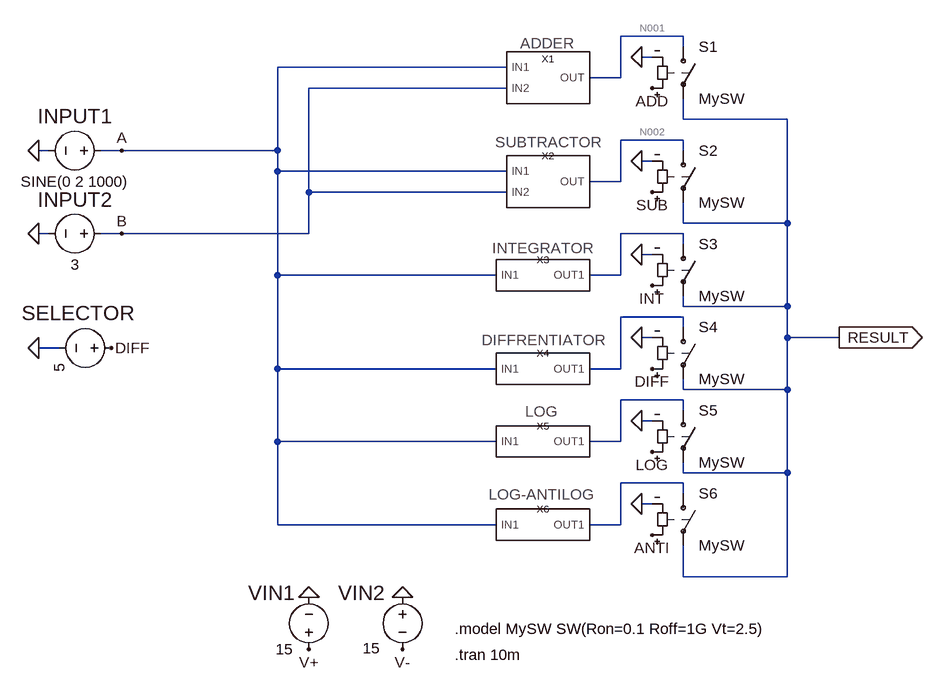
[diagram p0: schematic MAINCALCULATOR.asc]
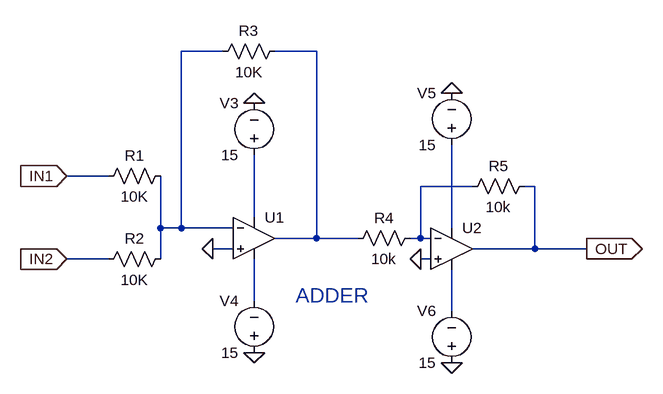
[diagram p1: sub-circuit adderblock.asc]
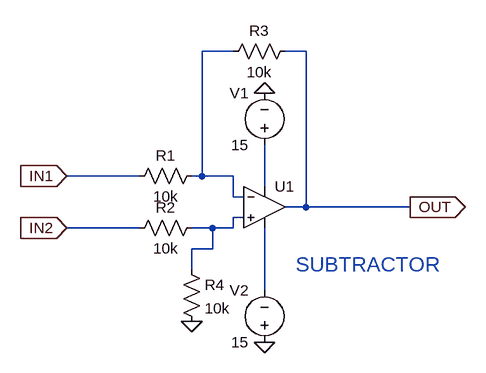
[diagram p2: sub-circuit subtractorblock.asc]
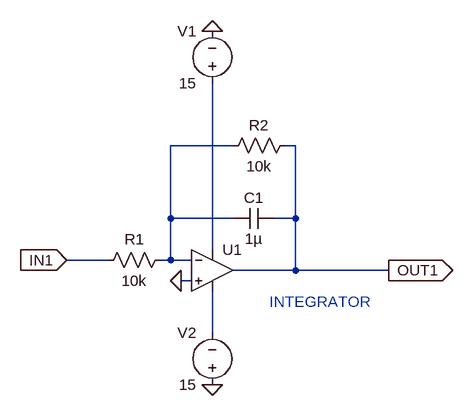
[diagram p3: sub-circuit integratorblock.asc]
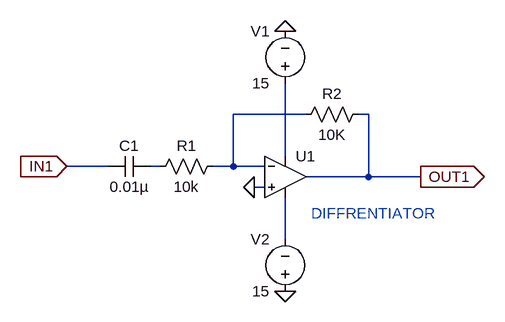
[diagram p4: sub-circuit diffrenetiatorblock.asc]
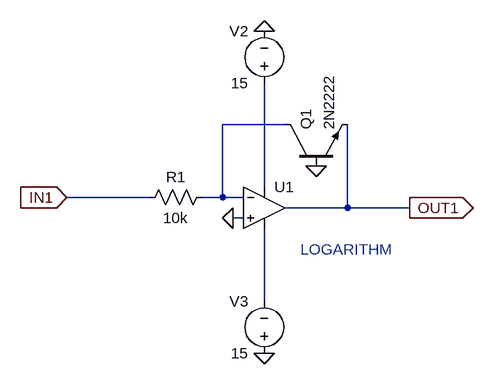
[diagram p5: sub-circuit logblock.asc]
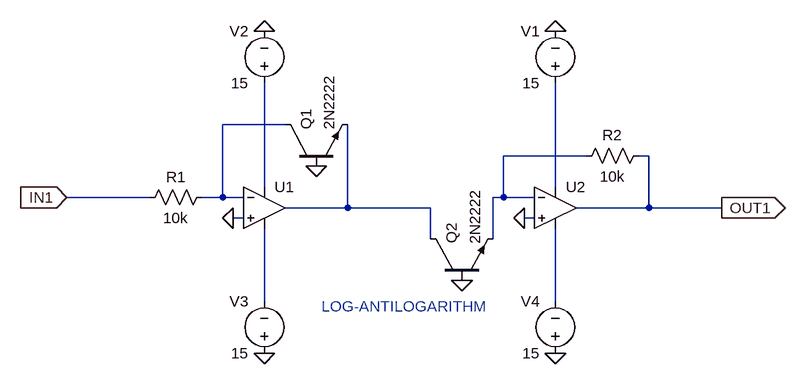
[diagram p6: sub-circuit logantilogblock.asc]
MAINCALCULATOR.asc, the LTspice schematic file:
Version 4.1
SHEET 1 900 1088
WIRE 416 64 320 64
WIRE 416 80 416 64
WIRE 368 96 352 96
WIRE 144 112 -208 112
WIRE 320 128 320 64
WIRE 320 128 272 128
WIRE 144 144 -160 144
WIRE 416 192 416 160
WIRE 576 192 416 192
WIRE 416 224 320 224
WIRE -560 240 -576 240
WIRE -448 240 -480 240
WIRE -208 240 -208 112
WIRE -208 240 -448 240
WIRE 416 240 416 224
WIRE 368 256 352 256
WIRE -208 272 -208 240
WIRE 144 272 -208 272
WIRE 320 288 320 224
WIRE 320 288 272 288
WIRE -160 304 -160 144
WIRE 144 304 -160 304
WIRE 416 352 416 320
WIRE 576 352 576 192
WIRE 576 352 416 352
WIRE -560 368 -576 368
WIRE -448 368 -480 368
WIRE -160 368 -160 304
WIRE -160 368 -448 368
WIRE 416 368 320 368
WIRE 416 384 416 368
WIRE 368 400 352 400
WIRE -208 432 -208 272
WIRE 128 432 -208 432
WIRE 320 432 320 368
WIRE 320 432 272 432
WIRE 416 480 416 464
WIRE 576 480 576 352
WIRE 576 480 416 480
WIRE 416 496 320 496
WIRE 416 512 416 496
WIRE 368 528 352 528
WIRE 576 528 576 480
WIRE 656 528 576 528
WIRE -544 544 -576 544
WIRE -208 576 -208 432
WIRE 128 576 -208 576
WIRE 320 576 320 496
WIRE 320 576 272 576
WIRE 416 608 416 592
WIRE 576 608 576 528
WIRE 576 608 416 608
WIRE 416 624 320 624
WIRE 416 640 416 624
WIRE 368 656 352 656
WIRE -208 688 -208 576
WIRE 128 688 -208 688
WIRE 320 688 320 624
WIRE 320 688 272 688
WIRE 416 736 416 720
WIRE 576 736 576 608
WIRE 576 736 416 736
WIRE 416 752 320 752
WIRE 416 768 416 752
WIRE 368 784 352 784
WIRE -208 816 -208 688
WIRE 128 816 -208 816
WIRE 320 816 320 752
WIRE 320 816 272 816
WIRE 416 896 416 848
WIRE 576 896 576 736
WIRE 576 896 416 896
FLAG -576 240 0
FLAG -576 368 0
FLAG -448 240 A
FLAG -448 368 B
FLAG 352 96 0
FLAG 352 256 0
FLAG 352 400 0
FLAG 352 528 0
FLAG 352 656 0
FLAG 352 784 0
FLAG 368 144 ADD
FLAG 368 304 SUB
FLAG 368 448 INT
FLAG 368 576 DIFF
FLAG 368 704 LOG
FLAG 368 832 ANTI
FLAG -16 1008 V-
FLAG -160 1008 V+
FLAG 656 528 RESULT
IOPIN 656 528 Out
FLAG -576 544 0
FLAG -464 544 DIFF
FLAG -16 928 0
FLAG -160 928 0
SYMBOL adderblock 208 128 R0
SYMATTR InstName X1
SYMBOL subtractorblock 208 288 R0
SYMATTR InstName X2
SYMBOL integratorblock 192 432 R0
SYMATTR InstName X3
SYMBOL diffrenetiatorblock 192 576 R0
SYMATTR InstName X4
SYMBOL logblock 192 688 R0
SYMATTR InstName X5
SYMBOL logantilogblock 192 816 R0
SYMATTR InstName X6
SYMBOL voltage -464 240 R90
WINDOW 0 -32 56 VBottom 3
WINDOW 3 32 56 VTop 2
WINDOW 123 0 0 Left 0
WINDOW 39 0 0 Left 0
SYMATTR InstName INPUT1
SYMATTR Value SINE(0 2 1000)
SYMBOL voltage -464 368 R90
WINDOW 0 -32 56 VBottom 3
WINDOW 3 32 56 VTop 2
WINDOW 123 0 0 Left 0
WINDOW 39 0 0 Left 0
SYMATTR InstName INPUT2
SYMATTR Value 3
SYMBOL sw 416 64 R0
SYMATTR InstName S1
SYMATTR Value MySW
SYMBOL sw 416 224 R0
SYMATTR InstName S2
SYMATTR Value MySW
SYMBOL sw 416 368 R0
SYMATTR InstName S3
SYMATTR Value MySW
SYMBOL sw 416 496 R0
SYMATTR InstName S4
SYMATTR Value MySW
SYMBOL sw 416 624 R0
SYMATTR InstName S5
SYMATTR Value MySW
SYMBOL sw 416 752 R0
SYMATTR InstName S6
SYMATTR Value MySW
SYMBOL voltage -448 544 R90
WINDOW 123 0 0 Left 0
WINDOW 39 0 0 Left 0
WINDOW 0 -54 -18 VRight 3
SYMATTR InstName SELECTOR
SYMATTR Value 5
SYMBOL voltage -16 912 R0
WINDOW 123 0 0 Left 0
WINDOW 39 0 0 Left 0
WINDOW 0 -63 9 Center 3
WINDOW 3 -61 94 Left 2
SYMATTR InstName VIN2
SYMATTR Value 15
SYMBOL voltage -160 1024 R180
WINDOW 0 58 103 Center 3
WINDOW 3 24 16 Left 2
WINDOW 123 0 0 Left 0
WINDOW 39 0 0 Left 0
SYMATTR InstName VIN1
SYMATTR Value 15
TEXT 64 976 Left 2 !.model MySW SW(Ron=0.1 Roff=1G Vt=2.5)
TEXT 64 1016 Left 2 !.tran 10m

adderblock.asc, the sub-circuit schematic file:
Version 4.1
SHEET 1 880 680
WIRE 48 -144 -16 -144
WIRE 192 -144 128 -144
WIRE -128 48 -192 48
WIRE 432 64 352 64
WIRE 528 64 512 64
WIRE 96 112 96 16
WIRE -48 128 -48 48
WIRE -16 128 -16 -144
WIRE -16 128 -48 128
WIRE 64 128 -16 128
WIRE 400 128 400 0
WIRE 192 144 192 -144
WIRE 192 144 128 144
WIRE 256 144 192 144
WIRE 352 144 352 64
WIRE 352 144 336 144
WIRE 368 144 352 144
WIRE 64 160 32 160
WIRE 528 160 528 64
WIRE 528 160 432 160
WIRE 608 160 528 160
WIRE -128 176 -192 176
WIRE -48 176 -48 128
WIRE 368 176 352 176
WIRE 96 240 96 176
WIRE 400 256 400 192
FLAG 32 160 0
FLAG 96 -64 0
FLAG 96 320 0
FLAG 352 176 0
FLAG 400 336 0
FLAG 400 -80 0
FLAG -192 48 IN1
IOPIN -192 48 In
FLAG -192 176 IN2
IOPIN -192 176 In
FLAG 608 160 OUT
IOPIN 608 160 Out
SYMBOL res -32 32 R90
WINDOW 0 0 56 VBottom 2
WINDOW 3 32 56 VTop 2
SYMATTR InstName R1
SYMATTR Value 10K
SYMBOL res -32 160 R90
WINDOW 0 0 56 VBottom 2
WINDOW 3 32 56 VTop 2
SYMATTR InstName R2
SYMATTR Value 10K
SYMBOL OpAmps\\UniversalOpAmp 96 144 R0
SYMATTR InstName U1
SYMBOL voltage 96 32 R180
WINDOW 0 24 96 Left 2
WINDOW 3 24 16 Left 2
WINDOW 123 0 0 Left 0
WINDOW 39 0 0 Left 0
SYMATTR InstName V3
SYMATTR Value 15
SYMBOL voltage 96 336 R180
WINDOW 0 24 96 Left 2
WINDOW 3 24 16 Left 2
WINDOW 123 0 0 Left 0
WINDOW 39 0 0 Left 0
SYMATTR InstName V4
SYMATTR Value 15
SYMBOL res 144 -160 R90
WINDOW 0 0 56 VBottom 2
WINDOW 3 32 56 VTop 2
SYMATTR InstName R3
SYMATTR Value 10K
SYMBOL OpAmps\\UniversalOpAmp 400 160 R0
SYMATTR InstName U2
SYMBOL res 352 128 R90
WINDOW 0 0 56 VBottom 2
WINDOW 3 32 56 VTop 2
SYMATTR InstName R4
SYMATTR Value 10k
SYMBOL res 528 48 R90
WINDOW 0 0 56 VBottom 2
WINDOW 3 32 56 VTop 2
SYMATTR InstName R5
SYMATTR Value 10k
SYMBOL voltage 400 16 R180
WINDOW 0 24 96 Left 2
WINDOW 3 24 16 Left 2
WINDOW 123 0 0 Left 0
WINDOW 39 0 0 Left 0
SYMATTR InstName V5
SYMATTR Value 15
SYMBOL voltage 400 352 R180
WINDOW 0 24 96 Left 2
WINDOW 3 24 16 Left 2
WINDOW 123 0 0 Left 0
WINDOW 39 0 0 Left 0
SYMATTR InstName V6
SYMATTR Value 15
TEXT 160 232 Left 3 ;ADDER

subtractorblock.asc, the sub-circuit schematic file:
Version 4.1
SHEET 1 880 680
WIRE 128 -64 80 -64
WIRE 240 -64 208 -64
WIRE -16 128 -128 128
WIRE 80 128 80 -64
WIRE 80 128 64 128
WIRE 128 128 80 128
WIRE 176 144 176 80
WIRE 128 160 128 128
WIRE 144 160 128 160
WIRE 240 176 240 -64
WIRE 240 176 208 176
WIRE 400 176 240 176
WIRE 144 192 128 192
WIRE -16 208 -128 208
WIRE 96 208 64 208
WIRE 128 208 128 192
WIRE 128 208 96 208
WIRE 96 240 96 208
WIRE 96 240 64 240
WIRE 64 272 64 240
WIRE 176 304 176 208
FLAG 176 384 0
FLAG 176 0 0
FLAG 64 352 0
FLAG -128 128 IN1
IOPIN -128 128 In
FLAG -128 208 IN2
IOPIN -128 208 In
FLAG 400 176 OUT
IOPIN 400 176 Out
SYMBOL OpAmps\\UniversalOpAmp 176 176 R0
SYMATTR InstName U1
SYMBOL voltage 176 96 R180
WINDOW 0 24 96 Left 2
WINDOW 3 24 16 Left 2
WINDOW 123 0 0 Left 0
WINDOW 39 0 0 Left 0
SYMATTR InstName V1
SYMATTR Value 15
SYMBOL voltage 176 400 R180
WINDOW 0 24 96 Left 2
WINDOW 3 24 16 Left 2
WINDOW 123 0 0 Left 0
WINDOW 39 0 0 Left 0
SYMATTR InstName V2
SYMATTR Value 15
SYMBOL res 80 112 R90
WINDOW 0 0 56 VBottom 2
WINDOW 3 32 56 VTop 2
SYMATTR InstName R1
SYMATTR Value 10k
SYMBOL res 80 192 R90
WINDOW 0 0 56 VBottom 2
WINDOW 3 32 56 VTop 2
SYMATTR InstName R2
SYMATTR Value 10k
SYMBOL res 224 -80 R90
WINDOW 0 0 56 VBottom 2
WINDOW 3 32 56 VTop 2
SYMATTR InstName R3
SYMATTR Value 10k
SYMBOL res 48 256 R0
SYMATTR InstName R4
SYMATTR Value 10k
TEXT 224 264 Left 3 ;SUBTRACTOR

integratorblock.asc, the sub-circuit schematic file:
Version 4.1
SHEET 1 880 680
WIRE 272 -32 176 -32
WIRE 368 -32 352 -32
WIRE 176 80 176 -32
WIRE 272 80 176 80
WIRE 368 80 368 -32
WIRE 368 80 336 80
WIRE 240 128 240 -128
WIRE 80 144 16 144
WIRE 176 144 176 80
WIRE 176 144 160 144
WIRE 208 144 176 144
WIRE 368 160 368 80
WIRE 368 160 272 160
WIRE 512 160 368 160
WIRE 208 176 192 176
WIRE 240 256 240 192
FLAG 240 -208 0
FLAG 240 336 0
FLAG 192 176 0
FLAG 16 144 IN1
IOPIN 16 144 In
FLAG 512 160 OUT1
IOPIN 512 160 Out
SYMBOL OpAmps\\UniversalOpAmp 240 160 R0
SYMATTR InstName U1
SYMBOL voltage 240 -112 R180
WINDOW 0 24 96 Left 2
WINDOW 3 24 16 Left 2
WINDOW 123 0 0 Left 0
WINDOW 39 0 0 Left 0
SYMATTR InstName V1
SYMATTR Value 15
SYMBOL voltage 240 352 R180
WINDOW 0 24 96 Left 2
WINDOW 3 24 16 Left 2
WINDOW 123 0 0 Left 0
WINDOW 39 0 0 Left 0
SYMATTR InstName V2
SYMATTR Value 15
SYMBOL res 176 128 R90
WINDOW 0 0 56 VBottom 2
WINDOW 3 32 56 VTop 2
SYMATTR InstName R1
SYMATTR Value 10k
SYMBOL cap 336 64 R90
WINDOW 0 0 32 VBottom 2
WINDOW 3 32 32 VTop 2
SYMATTR InstName C1
SYMATTR Value 1µ
SYMBOL res 368 -48 R90
WINDOW 0 0 56 VBottom 2
WINDOW 3 32 56 VTop 2
SYMATTR InstName R2
SYMATTR Value 10k
TEXT 328 208 Left 2 ;INTEGRATOR

diffrenetiatorblock.asc, the sub-circuit schematic file:
Version 4.1
SHEET 1 880 680
WIRE 272 64 160 64
WIRE 368 64 352 64
WIRE 240 128 240 16
WIRE -32 144 -96 144
WIRE 48 144 32 144
WIRE 160 144 160 64
WIRE 160 144 128 144
WIRE 208 144 160 144
WIRE 368 160 368 64
WIRE 368 160 272 160
WIRE 448 160 368 160
WIRE 208 176 192 176
WIRE 240 256 240 192
FLAG 240 -64 0
FLAG 240 336 0
FLAG 192 176 0
FLAG -96 144 IN1
IOPIN -96 144 In
FLAG 448 160 OUT1
IOPIN 448 160 Out
SYMBOL OpAmps\\UniversalOpAmp 240 160 R0
SYMATTR InstName U1
SYMBOL voltage 240 32 R180
WINDOW 0 24 96 Left 2
WINDOW 3 24 16 Left 2
WINDOW 123 0 0 Left 0
WINDOW 39 0 0 Left 0
SYMATTR InstName V1
SYMATTR Value 15
SYMBOL voltage 240 352 R180
WINDOW 0 24 96 Left 2
WINDOW 3 24 16 Left 2
WINDOW 123 0 0 Left 0
WINDOW 39 0 0 Left 0
SYMATTR InstName V2
SYMATTR Value 15
SYMBOL res 368 48 R90
WINDOW 0 0 56 VBottom 2
WINDOW 3 32 56 VTop 2
SYMATTR InstName R2
SYMATTR Value 10K
SYMBOL cap 32 128 R90
WINDOW 0 0 32 VBottom 2
WINDOW 3 32 32 VTop 2
SYMATTR InstName C1
SYMATTR Value 0.01µ
SYMBOL res 144 128 R90
WINDOW 0 0 56 VBottom 2
WINDOW 3 32 56 VTop 2
SYMATTR InstName R1
SYMATTR Value 10k
TEXT 280 216 Left 2 ;DIFFRENTIATOR

logblock.asc, the sub-circuit schematic file:
Version 4.1
SHEET 1 900 680
WIRE 144 64 48 64
WIRE 112 160 112 0
WIRE -64 176 -192 176
WIRE 48 176 48 64
WIRE 48 176 16 176
WIRE 80 176 48 176
WIRE 240 192 240 64
WIRE 240 192 144 192
WIRE 336 192 240 192
WIRE 80 208 64 208
WIRE 112 336 112 224
FLAG 112 -80 0
FLAG 112 416 0
FLAG 64 208 0
FLAG 192 128 0
FLAG -192 176 IN1
IOPIN -192 176 In
FLAG 336 192 OUT1
IOPIN 336 192 Out
SYMBOL OpAmps\\UniversalOpAmp 112 192 R0
SYMATTR InstName U1
SYMBOL res 32 160 R90
WINDOW 0 0 56 VBottom 2
WINDOW 3 32 56 VTop 2
SYMATTR InstName R1
SYMATTR Value 10k
SYMBOL voltage 112 16 R180
WINDOW 0 24 96 Left 2
WINDOW 3 24 16 Left 2
WINDOW 123 0 0 Left 0
WINDOW 39 0 0 Left 0
SYMATTR InstName V2
SYMATTR Value 15
SYMBOL voltage 112 432 R180
WINDOW 0 24 96 Left 2
WINDOW 3 24 16 Left 2
WINDOW 123 0 0 Left 0
WINDOW 39 0 0 Left 0
SYMATTR InstName V3
SYMATTR Value 15
SYMBOL npn 144 128 R270
SYMATTR InstName Q1
SYMATTR Value 2N2222
TEXT 168 256 Left 2 ;LOGARITHM

logantilogblock.asc, the sub-circuit schematic file:
Version 4.1
SHEET 1 940 680
WIRE 144 64 48 64
WIRE 608 112 480 112
WIRE 704 112 688 112
WIRE 112 160 112 0
WIRE 560 160 560 0
WIRE -64 176 -192 176
WIRE 48 176 48 64
WIRE 48 176 16 176
WIRE 80 176 48 176
WIRE 480 176 480 112
WIRE 480 176 464 176
WIRE 528 176 480 176
WIRE 240 192 240 64
WIRE 240 192 144 192
WIRE 368 192 240 192
WIRE 704 192 704 112
WIRE 704 192 592 192
WIRE 816 192 704 192
WIRE 80 208 64 208
WIRE 528 208 512 208
WIRE 368 240 368 192
WIRE 464 240 464 176
WIRE 112 336 112 224
WIRE 560 336 560 224
FLAG 112 -80 0
FLAG 560 -80 0
FLAG 560 416 0
FLAG 112 416 0
FLAG 64 208 0
FLAG 512 208 0
FLAG 192 128 0
FLAG 416 304 0
FLAG -192 176 IN1
IOPIN -192 176 In
FLAG 816 192 OUT1
IOPIN 816 192 Out
SYMBOL OpAmps\\UniversalOpAmp 112 192 R0
SYMATTR InstName U1
SYMBOL OpAmps\\UniversalOpAmp 560 192 R0
SYMATTR InstName U2
SYMBOL res 32 160 R90
WINDOW 0 0 56 VBottom 2
WINDOW 3 32 56 VTop 2
SYMATTR InstName R1
SYMATTR Value 10k
SYMBOL res 704 96 R90
WINDOW 0 0 56 VBottom 2
WINDOW 3 32 56 VTop 2
SYMATTR InstName R2
SYMATTR Value 10k
SYMBOL voltage 560 16 R180
WINDOW 0 24 96 Left 2
WINDOW 3 24 16 Left 2
WINDOW 123 0 0 Left 0
WINDOW 39 0 0 Left 0
SYMATTR InstName V1
SYMATTR Value 15
SYMBOL voltage 112 16 R180
WINDOW 0 24 96 Left 2
WINDOW 3 24 16 Left 2
WINDOW 123 0 0 Left 0
WINDOW 39 0 0 Left 0
SYMATTR InstName V2
SYMATTR Value 15
SYMBOL voltage 112 432 R180
WINDOW 0 24 96 Left 2
WINDOW 3 24 16 Left 2
WINDOW 123 0 0 Left 0
WINDOW 39 0 0 Left 0
SYMATTR InstName V3
SYMATTR Value 15
SYMBOL voltage 560 432 R180
WINDOW 0 24 96 Left 2
WINDOW 3 24 16 Left 2
WINDOW 123 0 0 Left 0
WINDOW 39 0 0 Left 0
SYMATTR InstName V4
SYMATTR Value 15
SYMBOL npn 144 128 R270
SYMATTR InstName Q1
SYMATTR Value 2N2222
SYMBOL npn 368 304 R270
SYMATTR InstName Q2
SYMATTR Value 2N2222
TEXT 200 344 Left 2 ;LOG-ANTILOGARITHM

The netlist it stands for:
* MAINCALCULATOR.asc
X§X1 A B N001 adderblock
X§X2 A B N002 subtractorblock
X§X3 A N003 integratorblock
X§X4 A N004 diffrenetiatorblock
X§X5 A N005 logblock
X§X6 A N006 logantilogblock
V§INPUT1 A 0 SINE(0 2 1000)
V§INPUT2 B 0 3
S1 N001 RESULT ADD 0 MySW
S2 N002 RESULT SUB 0 MySW
S3 N003 RESULT INT 0 MySW
S4 N004 RESULT DIFF 0 MySW
S5 N005 RESULT LOG 0 MySW
S6 N006 RESULT ANTI 0 MySW
V§SELECTOR DIFF 0 5
VIN2 0 V- 15
VIN1 V+ 0 15

* block symbol definitions
.subckt adderblock IN1 IN2 OUT
R1 N001 IN1 10K
R2 N001 IN2 10K
X§U1 0 N001 N004 N006 N002 level1 Avol=1Meg GBW=10Meg Vos=0 En=0 Enk=0 In=0 Ink=0 Rin=500Meg  ; pins In+ In- V+ V- OUT
V3 N004 0 15
V4 0 N006 15
R3 N002 N001 10K
X§U2 0 N003 N005 N007 OUT level1 Avol=1Meg GBW=10Meg Vos=0 En=0 Enk=0 In=0 Ink=0 Rin=500Meg  ; pins In+ In- V+ V- OUT
R4 N003 N002 10k
R5 OUT N003 10k
V5 N005 0 15
V6 0 N007 15
* ADDER
.ends adderblock

.subckt subtractorblock IN1 IN2 OUT
X§U1 N003 N001 N002 N004 OUT level1 Avol=1Meg GBW=10Meg Vos=0 En=0 Enk=0 In=0 Ink=0 Rin=500Meg  ; pins In+ In- V+ V- OUT
V1 N002 0 15
V2 0 N004 15
R1 N001 IN1 10k
R2 N003 IN2 10k
R3 OUT N001 10k
R4 N003 0 10k
* SUBTRACTOR
.ends subtractorblock

.subckt integratorblock IN1 OUT1
X§U1 0 N001 N002 N003 OUT1 level1 Avol=1Meg GBW=10Meg Vos=0 En=0 Enk=0 In=0 Ink=0 Rin=500Meg  ; pins In+ In- V+ V- OUT
V1 N002 0 15
V2 0 N003 15
R1 N001 IN1 10k
C1 OUT1 N001 1µ
R2 OUT1 N001 10k
* INTEGRATOR
.ends integratorblock

.subckt diffrenetiatorblock IN1 OUT1
X§U1 0 N001 N002 N004 OUT1 level1 Avol=1Meg GBW=10Meg Vos=0 En=0 Enk=0 In=0 Ink=0 Rin=500Meg  ; pins In+ In- V+ V- OUT
V1 N002 0 15
V2 0 N004 15
R2 OUT1 N001 10K
C1 N003 IN1 0.01µ
R1 N001 N003 10k
* DIFFRENTIATOR
.ends diffrenetiatorblock

.subckt logblock IN1 OUT1
X§U1 0 N001 N002 N003 OUT1 level1 Avol=1Meg GBW=10Meg Vos=0 En=0 Enk=0 In=0 Ink=0 Rin=500Meg  ; pins In+ In- V+ V- OUT
R1 N001 IN1 10k
V2 N002 0 15
V3 0 N003 15
Q1 N001 0 OUT1 0 2N2222
* LOGARITHM
.ends logblock

.subckt logantilogblock IN1 OUT1
X§U1 0 N001 N003 N006 N005 level1 Avol=1Meg GBW=10Meg Vos=0 En=0 Enk=0 In=0 Ink=0 Rin=500Meg  ; pins In+ In- V+ V- OUT
X§U2 0 N002 N004 N007 OUT1 level1 Avol=1Meg GBW=10Meg Vos=0 En=0 Enk=0 In=0 Ink=0 Rin=500Meg  ; pins In+ In- V+ V- OUT
R1 N001 IN1 10k
R2 OUT1 N002 10k
V1 N004 0 15
V2 N003 0 15
V3 0 N006 15
V4 0 N007 15
Q1 N001 0 N005 0 2N2222
Q2 N005 0 N002 0 2N2222
* LOG-ANTILOGARITHM
.ends logantilogblock

.model NPN NPN
.model PNP PNP
.lib standard.bjt
.model MySW SW(Ron=0.1 Roff=1G Vt=2.5)
.tran 10m
.lib UniversalOpAmp1.lib
.backanno
.end

* Results of the author's LTspice run, read from the files saved beside the schematic
* Operating Point, zero values left out:
*   V(b) = 3 V
*   V(diff) = 5 V
*   V(n001) = 3 V
*   V(n002) = 3 V
*   V(v+) = 15 V
*   V(v-) = -15 V
*   I(INPUT1) = 150 µA
*   I(INPUT2) = -450 µA
*   I(S1) = -3.003 nA
*   I(S2) = -3.003 nA
*   I(S4) = 6.006 nA
*   Ix(x1:in1) = -300 pA
*   Ix(x1:in2) = 300 µA
*   Ix(x1:out) = -4.907 nA
*   Ix(x2:in1) = -150 µA
*   Ix(x2:in2) = 150 µA
*   Ix(x2:out) = -4.456 nA
*   Ix(x4:out1) = 5.588 nA
*   Ix(x5:out1) = 3.858 pA